# Altium schematic sheet Sheet2.SchDoc
size A4; SheetNumber: 1; SheetTotal: 2
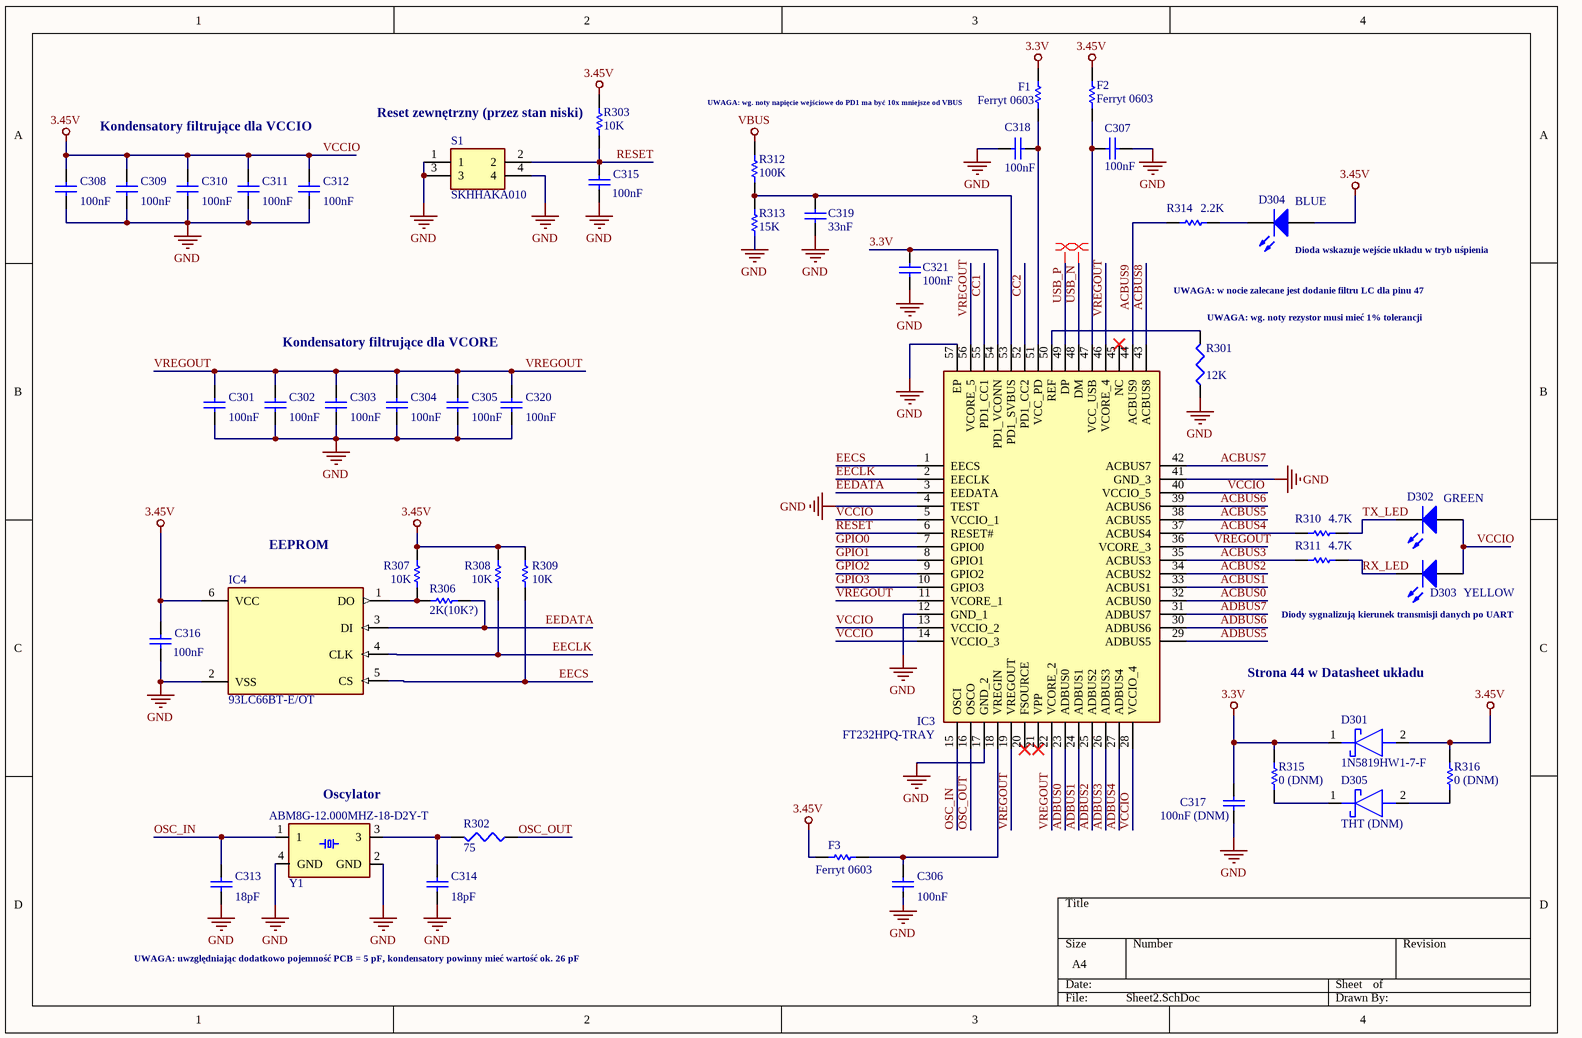
[diagram p0: Sheet2.SchDoc]

## Parts
C301  value 100nF  [1608[0603]]  (hidden comment: Cap Semi)
C302  value 100nF  [1608[0603]]  (hidden comment: Cap Semi)
C303  value 100nF  [1608[0603]]  (hidden comment: Cap Semi)
C304  value 100nF  [1608[0603]]  (hidden comment: Cap Semi)
C305  value 100nF  [1608[0603]]  (hidden comment: Cap Semi)
C306  value 100nF  [1608[0603]]  (hidden comment: Cap Semi)
C307  value 100nF  [1608[0603]]  (hidden comment: Cap Semi)
C308  value 100nF  [1608[0603]]  (hidden comment: Cap Semi)
C309  value 100nF  [1608[0603]]  (hidden comment: Cap Semi)
C310  value 100nF  [1608[0603]]  (hidden comment: Cap Semi)
C311  value 100nF  [1608[0603]]  (hidden comment: Cap Semi)
C312  value 100nF  [1608[0603]]  (hidden comment: Cap Semi)
C313  value 18pF  [1608[0603]]  (hidden comment: Cap Semi)
C314  value 18pF  [1608[0603]]  (hidden comment: Cap Semi)
C315  value 100nF  [1608[0603]]  (hidden comment: Cap Semi)
C316  value 100nF  [1608[0603]]  (hidden comment: Cap Semi)
C317  value 100nF (DNM)  [1608[0603]]  (hidden comment: Cap Semi)
C318  value 100nF  [1608[0603]]  (hidden comment: Cap Semi)
C319  value 33nF  [1608[0603]]  (hidden comment: Cap Semi)
C320  value 100nF  [1608[0603]]  (hidden comment: Cap Semi)
C321  value 100nF  [1608[0603]]  (hidden comment: Cap Semi)
D301  1N5819HW1-7-F  [SODFL3518X115N]
D302  GREEN  [LEDC2012X80N]
D303  YELLOW  [LEDC2012X80N]
D304  BLUE  [LEDC2012X80N]
D305  THT (DNM)  [DIOAD1796W86L628D292]
F1  Ferryt 0603  [RESC1608X55N]
F2  Ferryt 0603  [RESC1608X55N]
F3  Ferryt 0603  [RESC1608X55N]
IC3  FT232HPQ-TRAY  [QFN50P800X800X90-57N-D]
IC4  93LC66BT-E/OT  [SOT95P280X145-6N]
R301  value 12K  [RESC1608X55N]  (hidden comment: Res3)
R302  value 75  [RESC1608X55N]  (hidden comment: Res3)
R303  10K  [RESC1608X55N]
R306  2K(10K?)  [RESC1608X55N]
R307  10K  [RESC1608X55N]
R308  10K  [RESC1608X55N]
R309  10K  [RESC1608X55N]
R310  4.7K  [RESC1608X55N]
R311  4.7K  [RESC1608X55N]
R312  100K  [RESC1608X55N]
R313  15K  [RESC1608X55N]
R314  2.2K  [RESC1608X55N]
R315  0 (DNM)  [RESC1608X55N]
R316  0 (DNM)  [RESC1608X55N]
S1  SKHHAKA010  [SKHHALA010]
Y1  ABM8G-12.000MHZ-18-D2Y-T  [OSCSC320X250X100N]

## Nets
3.3V: C317.1 C321.2 D301.1(K) F1.2 IC3.54(PD1_VCONN) R315.2
GND: C301.1 C302.1 C303.1 C304.1 C305.1 C306.1 C307.2 C308.1 C309.1 C310.1 C311.1 C312.1 C313.1 C314.1 C315.2 C316.2 C317.2 C318.1 C319.1 C320.1 C321.1 IC3.4(TEST) IC3.12(GND_1) IC3.17(GND_2) IC3.41(GND_3) IC3.57(EP) IC4.2(VSS) R301.1 R313.1 S1.1 S1.3 S1.4 Y1.2(GND) Y1.4(GND)
VBUS: R312.2
VCCIO: C308.2 C309.2 C310.2 C311.2 C312.2 C316.1 D301.2(A) D302.1(A) D303.1(A) D304.1(A) F2.1 F3.1 IC3.5(VCCIO_1) IC3.13(VCCIO_2) IC3.14(VCCIO_3) IC3.28(VCCIO_4) IC3.40(VCCIO_5) IC4.6(VCC) R303.2 R307.1 R308.1 R309.1 R316.2  [also labelled 3.45V]
ACBUS0: IC3.32(ACBUS0)
ACBUS1: IC3.33(ACBUS1)
ACBUS2: IC3.34(ACBUS2)
ACBUS3: IC3.35(ACBUS3) R311.1
ACBUS4: IC3.37(ACBUS4) R310.1
ACBUS5: IC3.38(ACBUS5)
ACBUS6: IC3.39(ACBUS6)
ACBUS7: IC3.42(ACBUS7)
ACBUS8: IC3.43(ACBUS8)
ACBUS9: IC3.44(ACBUS9) R314.1
ADBUS0: IC3.23(ADBUS0)
ADBUS1: IC3.24(ADBUS1)
ADBUS2: IC3.25(ADBUS2)
ADBUS3: IC3.26(ADBUS3)
ADBUS4: IC3.27(ADBUS4)
ADBUS5: IC3.29(ADBUS5)
ADBUS6: IC3.30(ADBUS6)
ADBUS7: IC3.31(ADBUS7)
CC1: IC3.55(PD1_CC1)
CC2: IC3.52(PD1_CC2)
EECLK: IC3.2(EECLK) IC4.4(CLK) R308.2
EECS: IC3.1(EECS) IC4.5(CS) R309.2
EEDATA: IC3.3(EEDATA) IC4.3(DI) R306.2
GPIO0: IC3.7(GPIO0)
GPIO1: IC3.8(GPIO1)
GPIO2: IC3.9(GPIO2)
GPIO3: IC3.10(GPIO3)
OSC_IN: C313.2 IC3.15(OSCI) Y1.1
OSC_OUT: IC3.16(OSCO) R302.1
RESET: C315.1 IC3.6(RESET#) R303.1 S1.2
RX_LED: D303.2(K) R311.2
TX_LED: D302.2(K) R310.2
USB_N: IC3.48(DM)
USB_P: IC3.49(DP)
VREGOUT: C301.2 C302.2 C303.2 C304.2 C305.2 C320.2 IC3.11(VCORE_1) IC3.19(VREGOUT) IC3.22(VCORE_2) IC3.36(VCORE_3) IC3.46(VCORE_4) IC3.56(VCORE_5)
NetC306_2: C306.2 F3.2 IC3.18(VREGIN)
NetC307_1: C307.1 F2.2 IC3.47(VCC_USB)
NetC314_2: C314.2 R302.2 Y1.3
NetC318_2: C318.2 F1.1 IC3.51(VCC_PD)
NetC319_2: C319.2 IC3.53(PD1_SVBUS) R312.1 R313.2
NetD304_2: D304.2(K) R314.2
NetD305_1: D305.1(K) R315.1
NetD305_2: D305.2(A) R316.1
NetIC3_50: IC3.50(REF) R301.2
NetIC4_1: IC4.1(DO) R306.1 R307.2

Not connected (* = marked no-connect by the designer): IC3 20(FSOURCE)* 21(VPP)* 45(NC)*

## Layout directives
differential pair: USB_N, USB_P

## Notes on the sheet
- (near R303) Reset zewnętrzny (przez stan niski)
- UWAGA: wg. noty napięcie wejściowe do PD1 ma być 10x mniejsze od VBUS
- Kondensatory filtrujące dla VCCIO
- (near D304) Dioda wskazuje wejście układu w tryb uśpienia
- UWAGA: w nocie zalecane jest dodanie filtru LC dla pinu 47
- Kondensatory filtrujące dla VCORE
- (near R301) UWAGA: wg. noty rezystor musi mieć 1% tolerancji
- (near IC4) EEPROM
- Diody sygnalizują kierunek transmisji danych po UART
- Strona 44 w Datasheet układu
- (near Y1) Oscylator
- UWAGA: uwzględniając dodatkowo pojemność PCB = 5 pF, kondensatory powinny mieć wartość ok. 26 pF

## Library data of the parts
C301-C321 = Cap Semi: Capacitor (Semiconductor SIM Model); Published: 8-Jun-2000; LatestRevisionDate: 29-May-2009; LatestRevisionNote: IPC-7351 Footprint Added.; PackageReference: C1206; Publisher: Altium Limited; PackageDescription: Chip Capacitor
D301 D305 = 1N5819HW1-7-F: Schottky Diode; Manufacturer_Name: Diodes Inc.; Datasheet Link: https://www.diodes.com/assets/Datasheets/1N5819HW1.pdf; Height: 1.15mm; Manufacturer_Part_Number: 1N5819HW1-7-F; Mouser Part Number: 621-1N5819HW1-7-F; Mouser Price/Stock: https://www.mouser.co.uk/ProductDetail/Diodes-Incorporated/1N5819HW1-7-F?qs=60RJRzIpcl9ACQG7Zn63jQ%3D%3D; Arrow Part Number: 1N5819HW1-7-F; Arrow Price/Stock: https://www.arrow.com/en/products/1n5819hw1-7-f/diodes-incorporated?region=nac
D302-D304 = LED2: Typical RED, GREEN, YELLOW, AMBER GaAs LED; Published: 8-Jun-2000; LatestRevisionDate: 17-Jul-2002; LatestRevisionNote: Re-released for DXP Platform.; PackageVersion: Feb-2002; PackageReference: 3.2X1.6X1.1; Publisher: Altium Limited; PackageDescription: SM LED; 2 Flat Leads
F1-F3 R303 R306-R316 = Resistor 0603: Small resistor symbol 0603; Manufacturer: Panasonic; Manufacturer Part Number: ERJ-2GEJ510X; Voltage Rating: 50V; Resistance: 51R; Power Rating: 100mW; Tolerance: 5%; Temperature Coefficient: 200ppm/°C; Supplier 1: Mouser; Supplier Part Number 1: 667-ERJ-2GEJ510X; RoHS: Yes; Category: Chip SMD Resistors; Stock 1: 49112; Pricing 1: 1=0,10000, 10=0,01900, 50=0,01900, 100=0,00800, 1000=0,00300, 10000=0,00300 (USD); Mount: Surface Mount; Case/Package: 0402; Case Code (Metric): 1005; Case Code (Imperial): 0402; Contact Plating: Tin; Size Code: 0402; Min Operating Temperature: -55°C; Max Operating Temperature: 155°C; Packaging: Tape and Reel; Package Quantity: 1; Resistor Type: Thick Film; Number of Terminations: 2; Termination: SMD/SMT; Max Power Dissipation: 100mW; Voltage Rating (DC): 50V; Features: Automotive AEC-Q200; Series: ERJ; Resistance Tolerance: 5%; Construction: Rectangular; Technology: THICK FILM; Length: 1mm; Width: 0.02inch; Height: 0.35mm; Depth: 0.5mm; REACH SVHC: No SVHC; Military Standard: Not; Lead Free: Lead Free; RoHS Compliant: Yes; ComponentLink1URL: https://datasheet.ciiva.com/34303/1986983-34303549.pdf?src-supplier=Jameco; ComponentLink1Description: https://datasheet.ciiva.com/34303/1986983-34303549.pdf?src-supplier=Jameco; ComponentLink2URL: https://datasheet.ciiva.com/30130/4aoa0000ce1-30130213.pdf?src-supplier=Onlinecomponents.com; ComponentLink2Description: https://datasheet.ciiva.com/30130/4aoa0000ce1-30130213.pdf?src-supplier=Onlinecomponents.com; ComponentLink3URL: https://datasheet.ciiva.com/16522/aoa0000ce1-16522823.pdf?src-supplier=Avnet+Asia; ComponentLink3Description: https://datasheet.ciiva.com/16522/aoa0000ce1-16522823.pdf?src-supplier=Avnet+Asia; ComponentLink4URL: https://datasheet.ciiva.com/16784/70260739-16784088.pdf?src-supplier=Allied+Electronics; ComponentLink4Description: https://datasheet.ciiva.com/16784/70260739-16784088.pdf?src-supplier=Allied+Electronics; ComponentLink5URL: https://datasheet.ciiva.com/43460/1500035-43460360.pdf?src-supplier=Farnell; ComponentLink5Description: https://datasheet.ciiva.com/43460/1500035-43460360.pdf?src-supplier=Farnell; ComponentLink6URL: https://datasheet.ciiva.com/9189/aoa0000ce1-9189069.pdf?src-supplier=Avnet; ComponentLink6Description: https://datasheet.ciiva.com/9189/aoa0000ce1-9189069.pdf?src-supplier=Avnet; ComponentLink7URL: https://datasheet.ciiva.com/46386/1500035-46386749.pdf?src-supplier=Element14; ComponentLink7Description: https://datasheet.ciiva.com/46386/1500035-46386749.pdf?src-supplier=Element14; ComponentLink8URL: https://datasheet.ciiva.com/28565/1678796-28565007.pdf?src-supplier=Element14; ComponentLink8Description: https://datasheet.ciiva.com/28565/1678796-28565007.pdf?src-supplier=Element14
IC3 = FT232HPQ-TRAY: Integrated Circuit; Manufacturer_Name: FTDI Chip; Datasheet Link: https://www.ftdichip.com/Support/Documents/DataSheets/ICs/DS_FT233HP.pdf; Height: 0.9mm; Manufacturer_Part_Number: FT232HPQ-TRAY; Mouser Part Number: 895-FT232HPQ-TRAY; Mouser Price/Stock: https://www.mouser.co.uk/ProductDetail/FTDI/FT232HPQ-TRAY?qs=DRkmTr78QAQOR9QDUJT%2FRg%3D%3D
IC4 = 93LC66BT-E/OT: Microwire Compatible Serial EEPROM; Package: None; Price: None; Value: *; MP: 93LC66BT-E/OT; Availability: Unavailable
R301 R302 = Res3: Resistor; Published: 8-Jun-2000; LatestRevisionDate: 29-May-2009; LatestRevisionNote: IPC-7351 Footprint Added.; PackageReference: J1-0603; Publisher: Altium Limited; PackageDescription: Chip Resistor
S1 = SKHHAKA010: Switch; Manufacturer_Name: ALPS; Datasheet Link: http://www.alps.com/prod/info/E/HTML/Tact/SnapIn/SKHH/SKHHAKA010.html; Manufacturer_Part_Number: SKHHAKA010; Mouser Part Number: 688-SKHHAK; Mouser Price/Stock: https://www.mouser.co.uk/ProductDetail/ALPS/SKHHAKA010?qs=seHrhfPpLDyPUsCTaeDTPQ%3D%3D; Arrow Part Number: SKHHAKA010; Arrow Price/Stock: https://www.arrow.com/en/products/skhhaka010/alps-electric?region=nac
Y1 = ABM8G-12.000MHZ-18-D2Y-T: 12MHz Â±20ppm Crystal 18pF 120 Ohms 4-SMD, No Lead; MF: Abracon; Value: *; SnapEDA_Link: https://www.snapeda.com/parts/ABM8G-12.000MHZ-18-D2Y-T/Abracon%20LLC/view-part/419259/?ref=snap; Digi-Key_Part_Number: 535-10261-1-ND; Digi-Key_Purchase_URL: https://www.digikey.com/product-detail/en/abracon-llc/ABM8G-12.000MHZ-18-D2Y-T/535-10261-1-ND/2218074?utm_source=snapeda&utm_medium=aggregator&utm_campaign=symbol; Package: SMD-4 Abracon; MP: ABM8G-12.000MHZ-18-D2Y-T